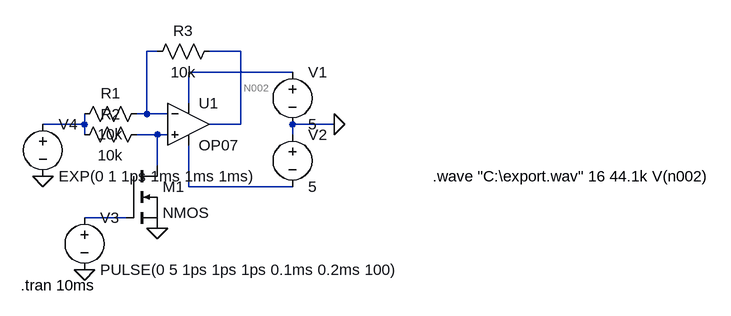
[diagram p0: schematic Draft1.asc]
Draft1.asc, the LTspice schematic file:
Version 4
SHEET 1 1068 680
WIRE 192 96 176 96
WIRE 320 96 272 96
WIRE 400 128 240 128
WIRE 240 176 240 128
WIRE 176 192 176 96
WIRE 176 192 160 192
WIRE 208 192 176 192
WIRE 80 208 80 192
WIRE 80 208 16 208
WIRE 320 208 320 96
WIRE 320 208 272 208
WIRE 464 208 400 208
WIRE 80 224 80 208
WIRE 192 224 160 224
WIRE 208 224 192 224
WIRE 400 224 400 208
WIRE 192 272 192 224
WIRE 240 304 240 240
WIRE 400 304 240 304
WIRE 144 352 80 352
FLAG 192 368 0
FLAG 16 288 0
FLAG 80 432 0
FLAG 464 208 0
SYMBOL Opamps\\OP07 240 144 R0
SYMATTR InstName U1
SYMBOL res 176 176 R90
WINDOW 0 0 56 VBottom 2
WINDOW 3 32 56 VTop 2
SYMATTR InstName R1
SYMATTR Value 10k
SYMBOL res 176 208 R90
WINDOW 0 0 56 VBottom 2
WINDOW 3 32 56 VTop 2
SYMATTR InstName R2
SYMATTR Value 10k
SYMBOL res 288 80 R90
WINDOW 0 0 56 VBottom 2
WINDOW 3 32 56 VTop 2
SYMATTR InstName R3
SYMATTR Value 10k
SYMBOL nmos 144 272 R0
SYMATTR InstName M1
SYMBOL voltage 400 112 R0
WINDOW 123 0 0 Left 2
WINDOW 39 0 0 Left 2
SYMATTR InstName V1
SYMATTR Value 5
SYMBOL voltage 400 208 R0
WINDOW 123 0 0 Left 2
WINDOW 39 0 0 Left 2
SYMATTR InstName V2
SYMATTR Value 5
SYMBOL voltage 80 336 R0
WINDOW 123 0 0 Left 2
WINDOW 39 0 0 Left 2
SYMATTR InstName V3
SYMATTR Value PULSE(0 5 1ps 1ps 1ps 0.1ms 0.2ms 100)
SYMBOL voltage 16 192 R0
WINDOW 123 0 0 Left 2
WINDOW 39 0 0 Left 2
SYMATTR InstName V4
SYMATTR Value EXP(0 1 1ps 1ms 1ms 1ms)
TEXT -18 456 Left 2 !.tran 10ms
TEXT 616 288 Left 2 !.wave "C:\\export.wav" 16 44.1k V(n002)

The netlist it stands for:
* Draft1.asc
XU1 N005 N001 N003 N006 N002 LT1001  ; OP07, pins In+ In- V+ V- OUT
R1 N001 N004 10k
R2 N005 N004 10k
R3 N002 N001 10k
M1 N005 N007 0 0 NMOS
V1 N003 0 5
V2 0 N006 5
V3 N007 0 PULSE(0 5 1ps 1ps 1ps 0.1ms 0.2ms 100)
V4 N004 0 EXP(0 1 1ps 1ms 1ms 1ms)
.model NMOS NMOS
.model PMOS PMOS
.lib standard.mos
.tran 10ms
.wave "C:\export.wav" 16 44.1k V(n002)
.lib LTC.lib
.backanno
.end